# EasyEDA schematic RC-BoatOnBoardController-Schematic-EASYEDA.json
TITLE: On Board Controller (RC-Boat); REV: 1.0; Date: 2026-02-16; Sheet: 1/1; Company: Colton Paul Badock
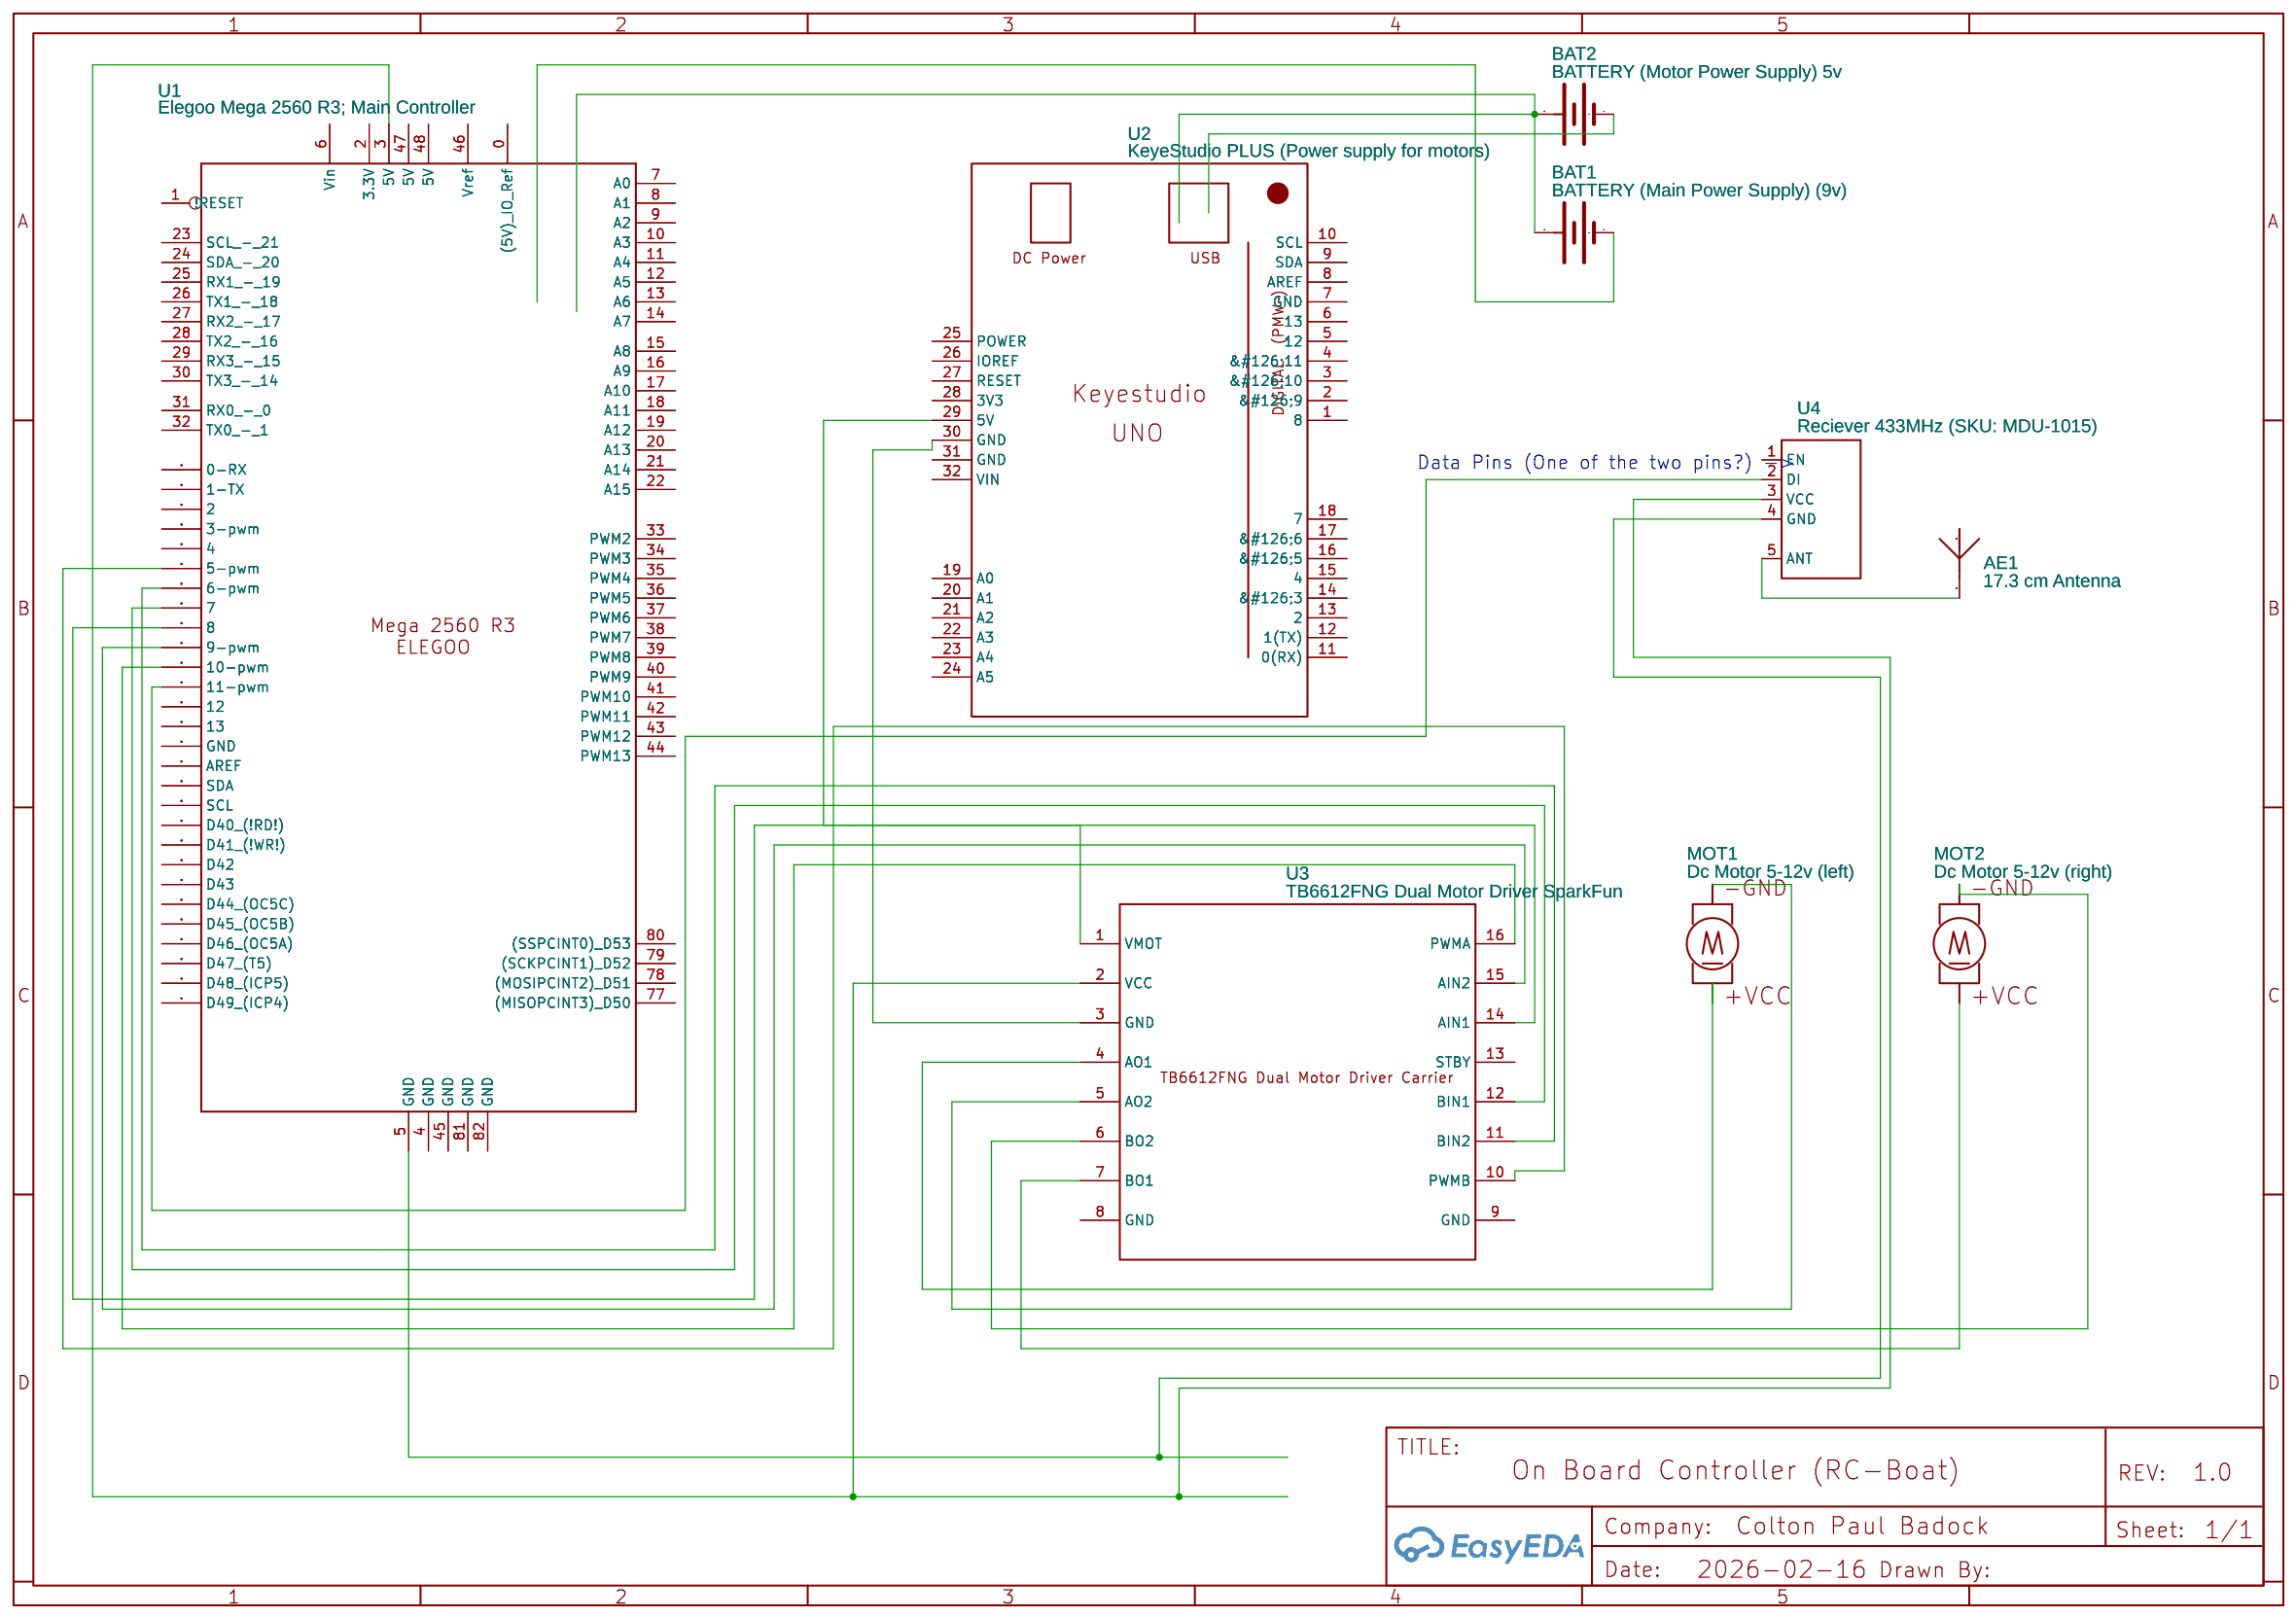
[diagram p0: schematic sheet]

## Parts
AE1  17.3 cm Antenna  [ANT-SMD_L3.2-W1.6]
BAT1  BATTERY (Main Power Supply) (9v)  [BATTCON_9V]
BAT2  BATTERY (Motor Power Supply) 5v  [BATTCON_9V]
MOT1  Dc Motor 5-12v (left)  [VIBRATION MOTOR - 3V COIN TYPE VIBRATION MOTOR 10000RPM]
MOT2  Dc Motor 5-12v (right)  [VIBRATION MOTOR - 3V COIN TYPE VIBRATION MOTOR 10000RPM]
U1  Elegoo Mega 2560 R3; Main Controller  [MEGA_2560_ELEGOO]
U2  KeyeStudio PLUS (Power supply for motors)  [ARDUINO KEYESTUDIO]
U3  TB6612FNG Dual Motor Driver SparkFun  [TB6612FNG DUAL MOTOR DRIVER BREAKOUT BOARD]
U4  Reciever 433MHz (SKU: MDU-1015)  [TXRF433MHZ]

## Library data of the parts
AE1 = 2450AT18A100E: Contributor: LCSC; Supplier: LCSC; Supplier Part: C89334; Manufacturer: JOHANSON(约翰逊); JLCPCB Part Class: Extended Part
BAT1 BAT2 = BATTERY: Contributor: SparkFun
MOT1 MOT2 = MOTOR DC ROAR: Supplier: LCSC; Supplier Part: C2759984; Manufacturer: LEADER(立得); Manufacturer Part: LCM1027A2445F; JLCPCB Part Class: Extended Part; Contributor: contact.krishnapriyan
U1 = MEGAARDUINO_2560_R3 COPY: subpart_no: 1; Manufacturer Part: MEGA2560 R3; Supplier: Amazon; Supplier Part: ELEGO MEGA2560 R3; Manufacturer: ELEGOO; link: https://www.amazon.fr/gp/product/B06XKZY117?pf_rd_p=3369e5a6-6989-43dc-ad01-b2b5ee1dcd12&pf_rd_r=AJCX6E77F3PBGRTJCSB7; Contributor: drvkatwijk
U2 = Keyestudio uno UNO R3 BOARD COPY: Manufacturer: keyestudio; Manufacturer Part: ARDUINO UNO REV3; Supplier: keyestudio; Supplier Part: keyestudio; link: https://docs.arduino.cc/resources/datasheets/A000066-datasheet.pdf; Contributor: maryam63002
U3 = TB6612FNG Dual Motor Driver SparkFun: Contributor: JDeWitt1988; sourceId: YsmgyP7pj; link: https://www.aliexpress.us/item/2251832036778926.html
U4 = TX RF 433MHZ COPY: Contributor: KEATECH

## Nets
Net-(AE1-1): AE1.1(ANT) U4.5(ANT)
Net-(BAT1-+): BAT1.+ BAT2.+
Net-(U1-3): U1.3(5V) U3.2(VCC) U4.3(VCC)
Net-(U1-5): U1.5(GND) U4.4(GND)
Net-(U1-.): U1..(D42) U3.10(PWMB) U3.11(BIN2) U3.12(BIN1) U3.14(AIN1) U3.15(AIN2) U3.16(PWMA) U4.2(DI)
Net-(U2-29): U2.29(5V) U3.1(VMOT)
Net-(U2-30): U2.30(GND) U3.3(GND)

Not connected (* = marked no-connect by the designer): AE1 2; BAT1 -; BAT2 -; U1 0((5V) IO Ref) 1(!RESET) 2(3.3V) 4(GND) 6(Vin) 7(A0) 8(A1) 9(A2) 10(A3) 11(A4) 12(A5) 13(A6) 14(A7) 15(A8) 16(A9) 17(A10) 18(A11) 19(A12) 20(A13) 21(A14) 22(A15) 23(SCL - 21) 24(SDA - 20) 25(RX1 - 19) 26(TX1 - 18) 27(RX2 - 17) 28(TX2 - 16) 29(RX3 - 15) 30(TX3 - 14) 31(RX0 - 0) 32(TX0 - 1) 33(PWM2) 34(PWM3) 35(PWM4) 36(PWM5) 37(PWM6) 38(PWM7) 39(PWM8) 40(PWM9) 41(PWM10) 42(PWM11) 43(PWM12) 44(PWM13) 45(GND) 46(Vref) 47(5V) 48(5V) 77((MISOPCINT3) D50) 78((MOSIPCINT2) D51) 79((SCKPCINT1) D52) 80((SSPCINT0) D53) 81(GND) 82(GND); U2 1(8) 2(&#126;9) 3(&#126;10) 4(&#126;11) 5(12) 6(13) 7(GND) 8(AREF) 9(SDA) 10(SCL) 11(0(RX)) 12(1(TX)) 13(2) 14(&#126;3) 15(4) 16(&#126;5) 17(&#126;6) 18(7) 19(A0) 20(A1) 21(A2) 22(A3) 23(A4) 24(A5) 25(POWER) 26(IOREF) 27(RESET) 28(3V3) 31(GND) 32(VIN); U3 4(AO1) 5(AO2) 6(BO2) 7(BO1) 8(GND) 9(GND) 13(STBY); U4 1(EN)

## Notes on the sheet
- Data Pins (One of the two pins?) ->
